# Altium project IRIS-FE-01-B.PrjPCB
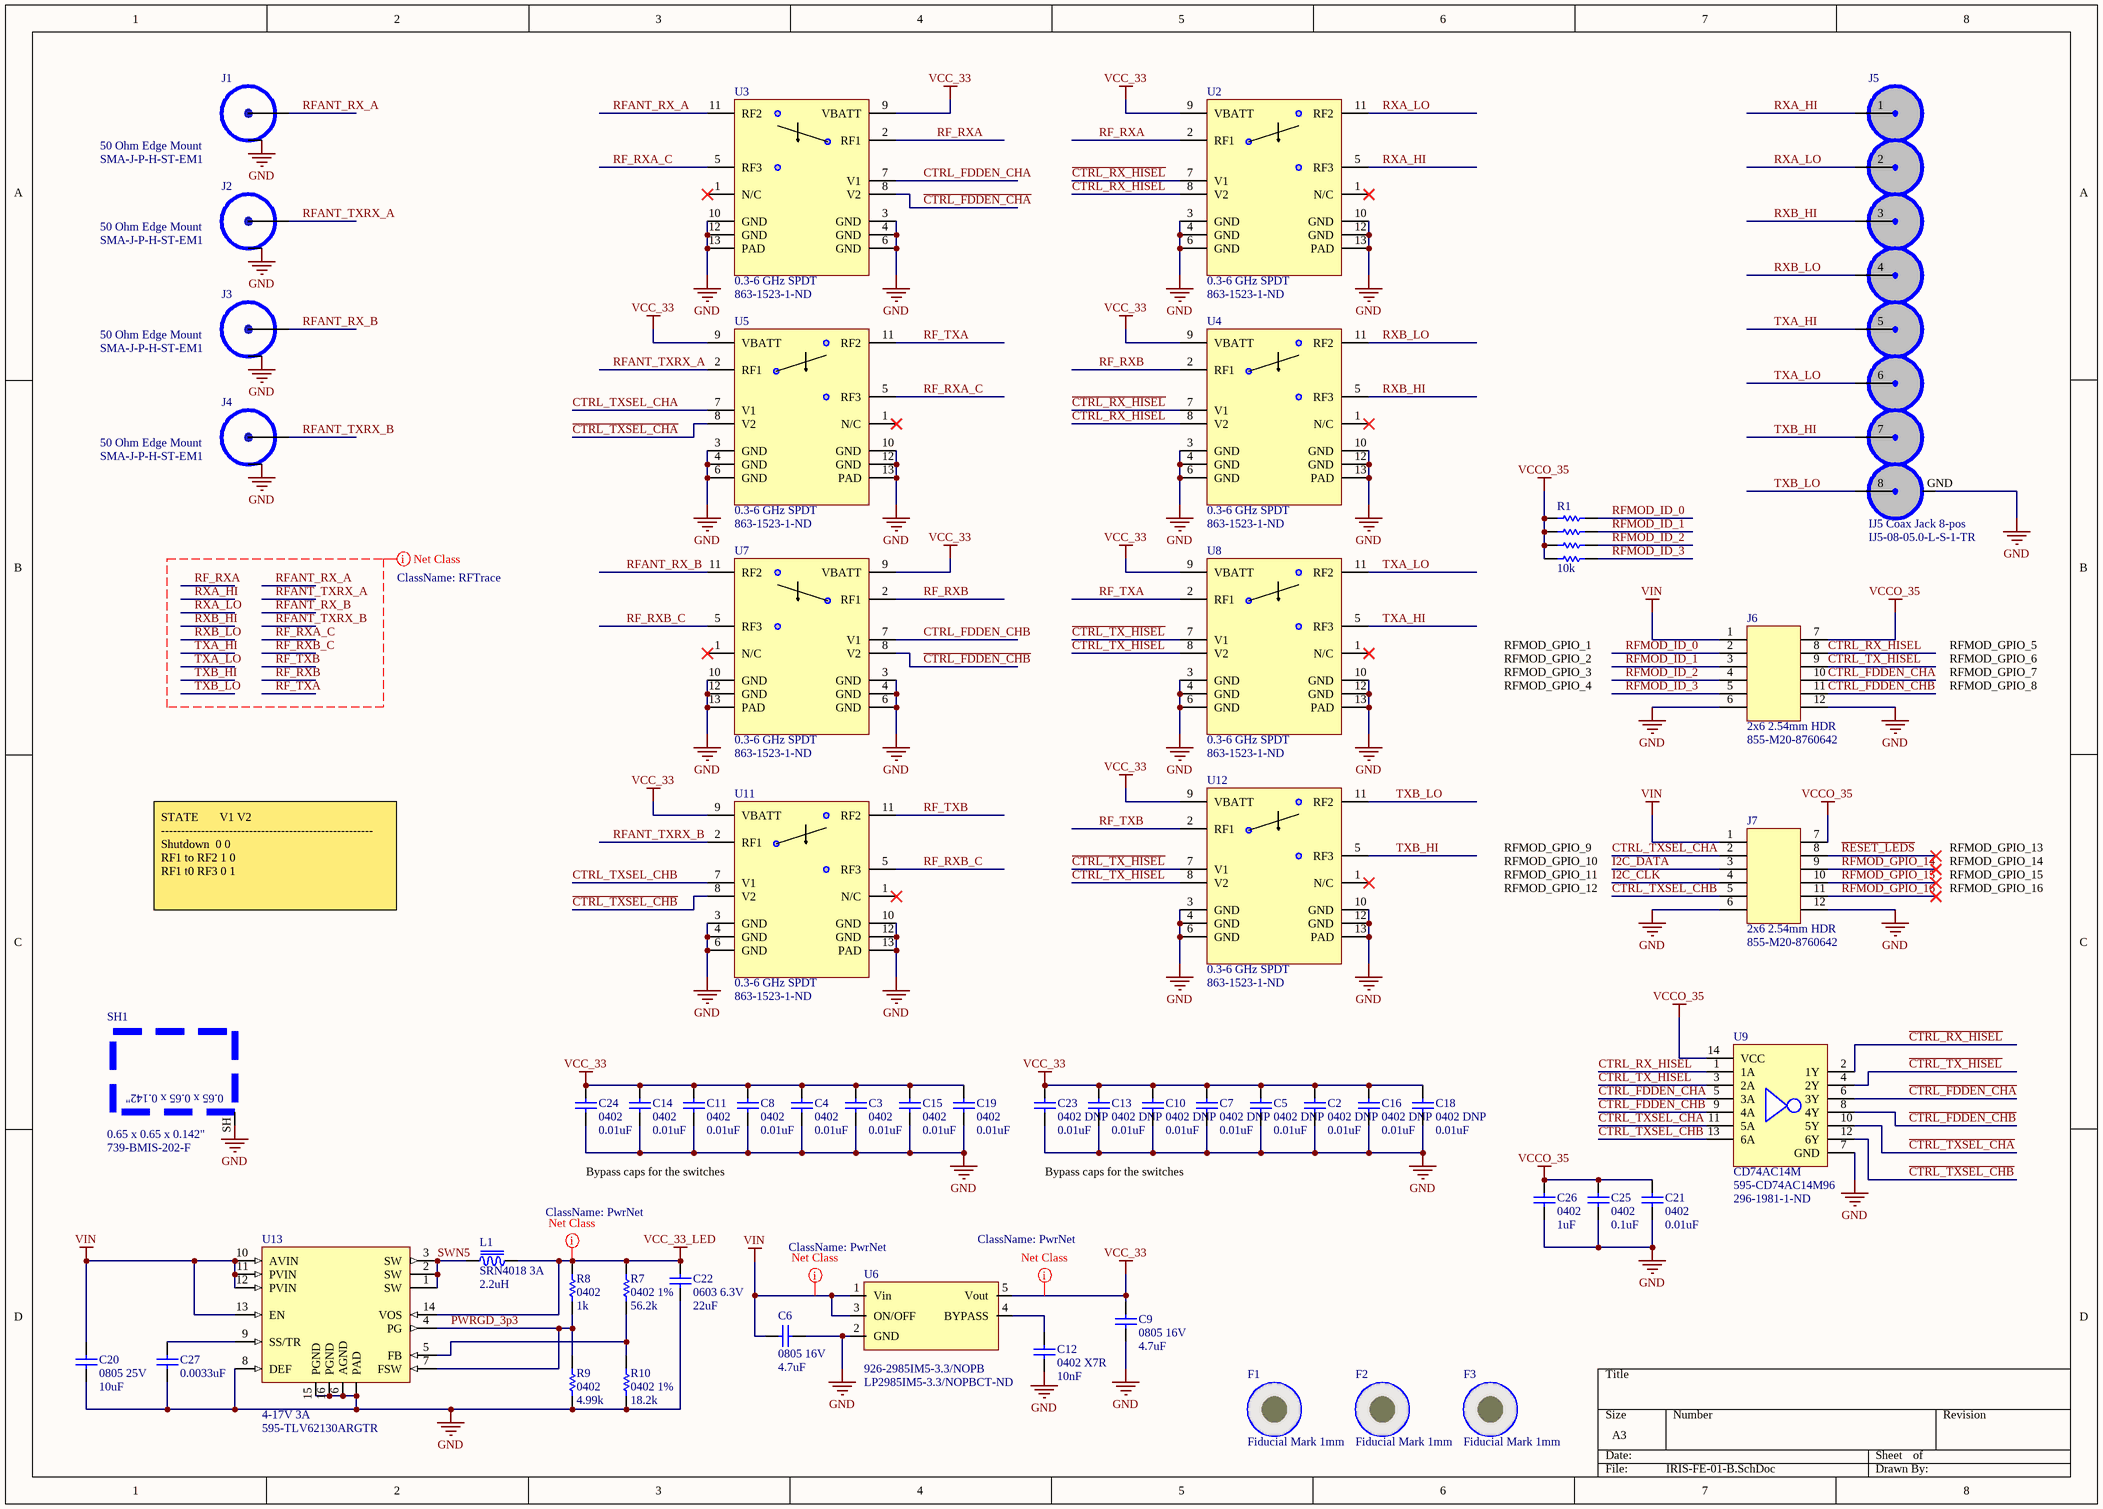
[diagram p0: IRIS-FE-01-B.SchDoc]
2 sheets, 79 parts. Net scope: global (net labels, ports and power ports of the same name join across sheets).
Board file: IRIS-FE-01-B.PcbDoc
Sheets:
  IRIS-FE-01-B.SchDoc
  IRIS-FE-01-B-LEDs.SchDoc

## Sheet IRIS-FE-01-B.SchDoc
size A3

### Parts
C2  0402 DNP  value 0.01uF  [0402_SMT_CAP]
C3  0402  value 0.01uF  [0402_SMT_CAP]
C4  0402  value 0.01uF  [0402_SMT_CAP]
C5  0402 DNP  value 0.01uF  [0402_SMT_CAP]
C6  0805 16V  value 4.7uF  [0805_SMT_CAP]
C7  0402 DNP  value 0.01uF  [0402_SMT_CAP]
C8  0402  value 0.01uF  [0402_SMT_CAP]
C9  0805 16V  value 4.7uF  [0805_SMT_CAP]
C10  0402 DNP  value 0.01uF  [0402_SMT_CAP]
C11  0402  value 0.01uF  [0402_SMT_CAP]
C12  0402 X7R  value 10nF  [0402_SMT_CAP]
C13  0402 DNP  value 0.01uF  [0402_SMT_CAP]
C14  0402  value 0.01uF  [0402_SMT_CAP]
C15  0402  value 0.01uF  [0402_SMT_CAP]
C16  0402 DNP  value 0.01uF  [0402_SMT_CAP]
C18  0402 DNP  value 0.01uF  [0402_SMT_CAP]
C19  0402  value 0.01uF  [0402_SMT_CAP]
C20  0805 25V  value 10uF  [0805_SMT_CAP]
C21  0402  value 0.01uF  [0402_SMT_CAP]
C22  0603 6.3V  value 22uF  [0603_SMT_CAP]
C23  0402 DNP  value 0.01uF  [0402_SMT_CAP]
C24  0402  value 0.01uF  [0402_SMT_CAP]
C25  0402  value 0.1uF  [0402_SMT_CAP]
C26  0402  value 1uF  [0402_SMT_CAP]
C27  value 0.0033uF  [0402_SMT_CAP]  (hidden comment: 0402)
F1  Fiducial Mark 1mm  [1mm_FIDUCIAL]
F2  Fiducial Mark 1mm  [1mm_FIDUCIAL]
F3  Fiducial Mark 1mm  [1mm_FIDUCIAL]
J1  50 Ohm Edge Mount  Manufacturer Part Number 1: SMA-J-P-H-ST-EM1  [SMA-J-P-X-ST-EM1]
J2  50 Ohm Edge Mount  Manufacturer Part Number 1: SMA-J-P-H-ST-EM1  [SMA-J-P-X-ST-EM1]
J3  50 Ohm Edge Mount  Manufacturer Part Number 1: SMA-J-P-H-ST-EM1  [SMA-J-P-X-ST-EM1]
J4  50 Ohm Edge Mount  Manufacturer Part Number 1: SMA-J-P-H-ST-EM1  [SMA-J-P-X-ST-EM1]
J5  IJ5 Coax Jack 8-pos  [IJ5-08-05.0-L-S-1-TR]
J6  2x6 2.54mm HDR  Supplier Part Number 1: 855-M20-8760642  [M20-876-350012]
J7  2x6 2.54mm HDR  Supplier Part Number 1: 855-M20-8760642  [M20-876-350012]
L1  SRN4018 3A  value 2.2uH  [srn4018]
R1  value 10k  [EXB28V]  (hidden comment: 0402 Array)
R7  0402 1%  value 56.2k  [0402_SMT_RES]
R8  0402  value 1k  [0402_SMT_RES]
R9  0402  value 4.99k  [0402_SMT_RES]
R10  0402 1%  value 18.2k  [0402_SMT_RES]
SH1  0.65 x 0.65 x 0.142"  Supplier Part Number 1: 739-BMIS-202-F  [BMIS-202]
U2  0.3-6 GHz SPDT  Supplier Part Number 1: 863-1523-1-ND  [SKY13374-397LF-QFN12]
U3  0.3-6 GHz SPDT  Supplier Part Number 1: 863-1523-1-ND  [SKY13374-397LF-QFN12]
U4  0.3-6 GHz SPDT  Supplier Part Number 1: 863-1523-1-ND  [SKY13374-397LF-QFN12]
U5  0.3-6 GHz SPDT  Supplier Part Number 1: 863-1523-1-ND  [SKY13374-397LF-QFN12]
U6  Supplier Part Number 1: 926-2985IM5-3.3/NOPB  Supplier Part Number 2: LP2985IM5-3.3/NOPBCT-ND  [DBV_SOT-23-5]  (hidden comment: LP2985IM5-3.3)
U7  0.3-6 GHz SPDT  Supplier Part Number 1: 863-1523-1-ND  [SKY13374-397LF-QFN12]
U8  0.3-6 GHz SPDT  Supplier Part Number 1: 863-1523-1-ND  [SKY13374-397LF-QFN12]
U9  CD74AC14M  Supplier Part Number 1: 595-CD74AC14M96  Supplier Part Number 2: 296-1981-1-ND  [TI-SOIC127P600X175-14N]
U11  0.3-6 GHz SPDT  Supplier Part Number 1: 863-1523-1-ND  [SKY13374-397LF-QFN12]
U12  0.3-6 GHz SPDT  Supplier Part Number 1: 863-1523-1-ND  [SKY13374-397LF-QFN12]
U13  4-17V 3A  Supplier Part Number 1: 595-TLV62130ARGTR  [S-PVQFN-N16]

### Nets
GND: C2.2 C3.2 C4.2 C5.2 C6.2 C7.2 C8.2 C9.2 C10.2 C11.2 C12.1 C13.2 C14.2 C15.2 C16.2 C18.2 C19.2 C20.1 C21.2 C22.2 C23.2 C24.2 C25.1 C26.2 C27.1 J1.2(GND) J2.2(GND) J3.2(GND) J4.2(GND) J5.GND J6.6 J6.12 J7.6 J7.12 R9.1 R10.1 SH1.SH U2.3(GND) U2.4(GND) U2.6(GND) U2.10(GND) U2.12(GND) U2.13(PAD) U3.3(GND) U3.4(GND) U3.6(GND) U3.10(GND) U3.12(GND) U3.13(PAD) U4.3(GND) U4.4(GND) U4.6(GND) U4.10(GND) U4.12(GND) U4.13(PAD) U5.3(GND) U5.4(GND) U5.6(GND) U5.10(GND) U5.12(GND) U5.13(PAD) U6.2(GND) U7.3(GND) U7.4(GND) U7.6(GND) U7.10(GND) U7.12(GND) U7.13(PAD) U8.3(GND) U8.4(GND) U8.6(GND) U8.10(GND) U8.12(GND) U8.13(PAD) U9.7(GND) U11.3(GND) U11.4(GND) U11.6(GND) U11.10(GND) U11.12(GND) U11.13(PAD) U12.3(GND) U12.4(GND) U12.6(GND) U12.10(GND) U12.12(GND) U12.13(PAD) U13.6(AGND) U13.8(DEF) U13.15(PGND) U13.16(PGND) U13.17(PAD)
VCC_33: C2.1 C3.1 C4.1 C5.1 C7.1 C8.1 C9.1 C10.1 C11.1 C13.1 C14.1 C15.1 C16.1 C18.1 C19.1 C23.1 C24.1 U2.9(VBATT) U3.9(VBATT) U4.9(VBATT) U5.9(VBATT) U6.5(Vout) U7.9(VBATT) U8.9(VBATT) U11.9(VBATT) U12.9(VBATT)
VCC_33_LED: C22.1 L1.2 R7.2 R8.2 U13.14(VOS)
VCCO_35: C21.1 C25.2 C26.1 J6.7 J7.7 R1.1 R1.2 R1.3 R1.4 U9.14(VCC)
VIN: C6.1 C20.2 J6.1 J7.1 U6.1(Vin) U6.3(ON/OFF) U13.10(AVIN) U13.11(PVIN) U13.12(PVIN) U13.13(EN)
~{CTRL_FDDEN_CHA}: U3.8(V2) U9.6(3Y)
~{CTRL_FDDEN_CHB}: U7.8(V2) U9.8(4Y)
~{CTRL_RX_HISEL}: U2.7(V1) U4.7(V1) U9.2(1Y)
~{CTRL_TX_HISEL}: U8.7(V1) U9.4(2Y) U12.7(V1)
~{CTRL_TXSEL_CHA}: U5.8(V2) U9.10(5Y)
~{CTRL_TXSEL_CHB}: U9.12(6Y) U11.8(V2)
~{RESET_LEDS}: J7.8
CTRL_FDDEN_CHA: J6.10 U3.7(V1) U9.5(3A)
CTRL_FDDEN_CHB: J6.11 U7.7(V1) U9.9(4A)
CTRL_RX_HISEL: J6.8 U2.8(V2) U4.8(V2) U9.1(1A)
CTRL_TX_HISEL: J6.9 U8.8(V2) U9.3(2A) U12.8(V2)
CTRL_TXSEL_CHA: J7.2 U5.7(V1) U9.11(5A)
CTRL_TXSEL_CHB: J7.5 U9.13(6A) U11.7(V1)
I2C_CLK: J7.4
I2C_DATA: J7.3
PWRGD_3p3: R8.1 R9.2 U13.4(PG) U13.7(FSW)
RF_RXA: U2.2(RF1) U3.2(RF1)
RF_RXA_C: U3.5(RF3) U5.5(RF3)
RF_RXB: U4.2(RF1) U7.2(RF1)
RF_RXB_C: U7.5(RF3) U11.5(RF3)
RF_TXA: U5.11(RF2) U8.2(RF1)
RF_TXB: U11.11(RF2) U12.2(RF1)
RFANT_RX_A: J1.1(SIG) U3.11(RF2)
RFANT_RX_B: J3.1(SIG) U7.11(RF2)
RFANT_TXRX_A: J2.1(SIG) U5.2(RF1)
RFANT_TXRX_B: J4.1(SIG) U11.2(RF1)
RFMOD_GPIO_14: J7.9
RFMOD_GPIO_15: J7.10
RFMOD_GPIO_16: J7.11
RFMOD_ID_0: J6.2 R1.8
RFMOD_ID_1: J6.3 R1.7
RFMOD_ID_2: J6.4 R1.6
RFMOD_ID_3: J6.5 R1.5
RXA_HI: J5.1 U2.5(RF3)
RXA_LO: J5.2 U2.11(RF2)
RXB_HI: J5.3 U4.5(RF3)
RXB_LO: J5.4 U4.11(RF2)
SWN5: L1.1 U13.1(SW) U13.2(SW) U13.3(SW)
TXA_HI: J5.5 U8.5(RF3)
TXA_LO: J5.6 U8.11(RF2)
TXB_HI: J5.7 U12.5(RF3)
TXB_LO: J5.8 U12.11(RF2)
NetC12_2: C12.2 U6.4(BYPASS)
NetC27_2: C27.2 U13.9(SS/TR)
NetR7_1: R7.1 R10.2 U13.5(FB)

Not connected (* = marked no-connect by the designer): U2 1(N/C)*; U3 1(N/C)*; U4 1(N/C)*; U5 1(N/C)*; U7 1(N/C)*; U8 1(N/C)*; U11 1(N/C)*; U12 1(N/C)*

### Layout directives
net class PwrNet: VCC_33, VCC_33_LED, VIN
net class RFTrace: RF_RXA, RF_RXA_C, RF_RXB, RF_RXB_C, RF_TXA, RF_TXB, RFANT_RX_A, RFANT_RX_B, RFANT_TXRX_A, RFANT_TXRX_B, RXA_HI, RXA_LO, RXB_HI, RXB_LO, TXA_HI, TXA_LO, TXB_HI, TXB_LO

### Notes on the sheet
- RFMOD_GPIO_1
- RFMOD_GPIO_5
- RFMOD_GPIO_2
- RFMOD_GPIO_3
- RFMOD_GPIO_4
- RFMOD_GPIO_6
- RFMOD_GPIO_7
- RFMOD_GPIO_8
- RFMOD_GPIO_9
- RFMOD_GPIO_13
- STATE     		V1	V2
  -----------------------------------------------------
  Shutdown		0	0
  RF1 to RF2	1	0
  RF1 t0 RF3	0	1
- RFMOD_GPIO_10
- RFMOD_GPIO_11
- RFMOD_GPIO_12
- RFMOD_GPIO_14
- RFMOD_GPIO_15
- RFMOD_GPIO_16
- Bypass caps for the switches

### Library data of the parts
C2-C5 C7 C8 C10 C11 C13-C16 C18 C19 C21 C23-C27 = Cap_0402: 0402 SMT Capacitor; Supplier 1: Mouser
  C2-C5 C7 C8 C10 C11 C13-C16 C18 C19 C21 C23 C24: Supplier Part Number 1: 81-GRM155R71H103KA8D
  C25: Supplier Part Number 1: 81-GRM155R71C104JA8D
  C26: Supplier Part Number 1: 81-GRM155R61E105KA2D
  C27: Supplier Part Number 1: 81-GRM155R71H332KA1J
C6 C9 C20 = Cap_0805: 0805 SMT Capacitor; Supplier 1: Mouser
  C6 C9: Supplier Part Number 1: 81-GRJ21BR71C475KE1L
  C20: Supplier Part Number 1: 81-GRM219R61E106KA2D
C12 = Cap Semi: Capacitor (Semiconductor SIM Model); Published: 8-Jun-2000; LatestRevisionDate: 29-May-2009; LatestRevisionNote: IPC-7351 Footprint Added.; PackageReference: C1206; Publisher: Altium Limited; PackageDescription: Chip Capacitor; Supplier 1: Mouser; Supplier Part Number 1: 81-GCM155R71H103KA5D
C22 = Cap_0603: 0603 SMT Capacitor; Supplier 1: Mouser; Supplier Part Number 1: 81-GRM188R60J226ME0D
F1-F3 = Fiducial-1mm
J1-J4 = SMA-J-P-X-ST-EM1: Samtec SMA Edge Mount 50 Ohm; Manufacturer 1: Samtec; Supplier 1: Samtec; Supplier Part Number 1: SMA-J-P-H-ST-EM1
J5 = IJ5-08-05.0-X-S-1_1: Samtec 50 Ohm High Isolation RF Jack, 4-pos; Manufacturer 1: Samtec; Manufacturer Part Number 1: IJ5-08-05.0-L-S-1-TR; Supplier 1: Samtec; Supplier Part Number 1: IJ5-08-05.0-L-S-1-TR
J6 J7 = M20-8760642: Harwin 2.54mm Thru Straight Recepticle; Supplier 1: Mouser
L1 = SRN4018: SRN4018 Semi-Shielded SMT Power Inductor; Supplier 1: Mouser; Supplier Part Number 1: 652-SRN4018-2R2M
R1 = Res_0402_4xArray: 0402 SMT Resistor Array; Supplier 1: Mouser; Supplier Part Number 1: 667-EXB-28V103JX; Supplier 2: Digi-Key; Supplier Part Number 2: Y7103CT-ND
R7-R10 = Res_0402: 0402 SMT Resistor; Supplier 1: Mouser
  R7: Supplier Part Number 1: 667-ERJ-2RKF5622X
  R8: Supplier Part Number 1: 667-ERJ-2RKF1001X
  R9: Supplier Part Number 1: 667-ERJ-2RKF4991X
  R10: Supplier Part Number 1: 667-ERJ-2RKF1822X
SH1 = BMI-S-202-F: EMI Shield 0.65 x 0.65 x 0.142" LairdTech 2-pc; Supplier 1: Mouser
U2-U5 U7 U8 U11 U12 = SKY13374-397LF: 300 kHz to 6.0 GHz SPDT Switch 2x2mm QFN; Supplier 1: Digi-Key
U6 = LP2985IM5-3.3: TO LDO 3.3V 150mA Regulator w/ ON/OFF; Supplier 1: Mouser; Supplier 2: Digi-Key
U9 = CD74AC14M: TI Hex Inverter in SOIC; Supplier 1: Mouser; Supplier 2: Digi-Key
U13 = TLV62130: 4-17V 3A Step-Down Voltage Converter; Supplier 1: Mouser

## Sheet IRIS-FE-01-B-LEDs.SchDoc
size A
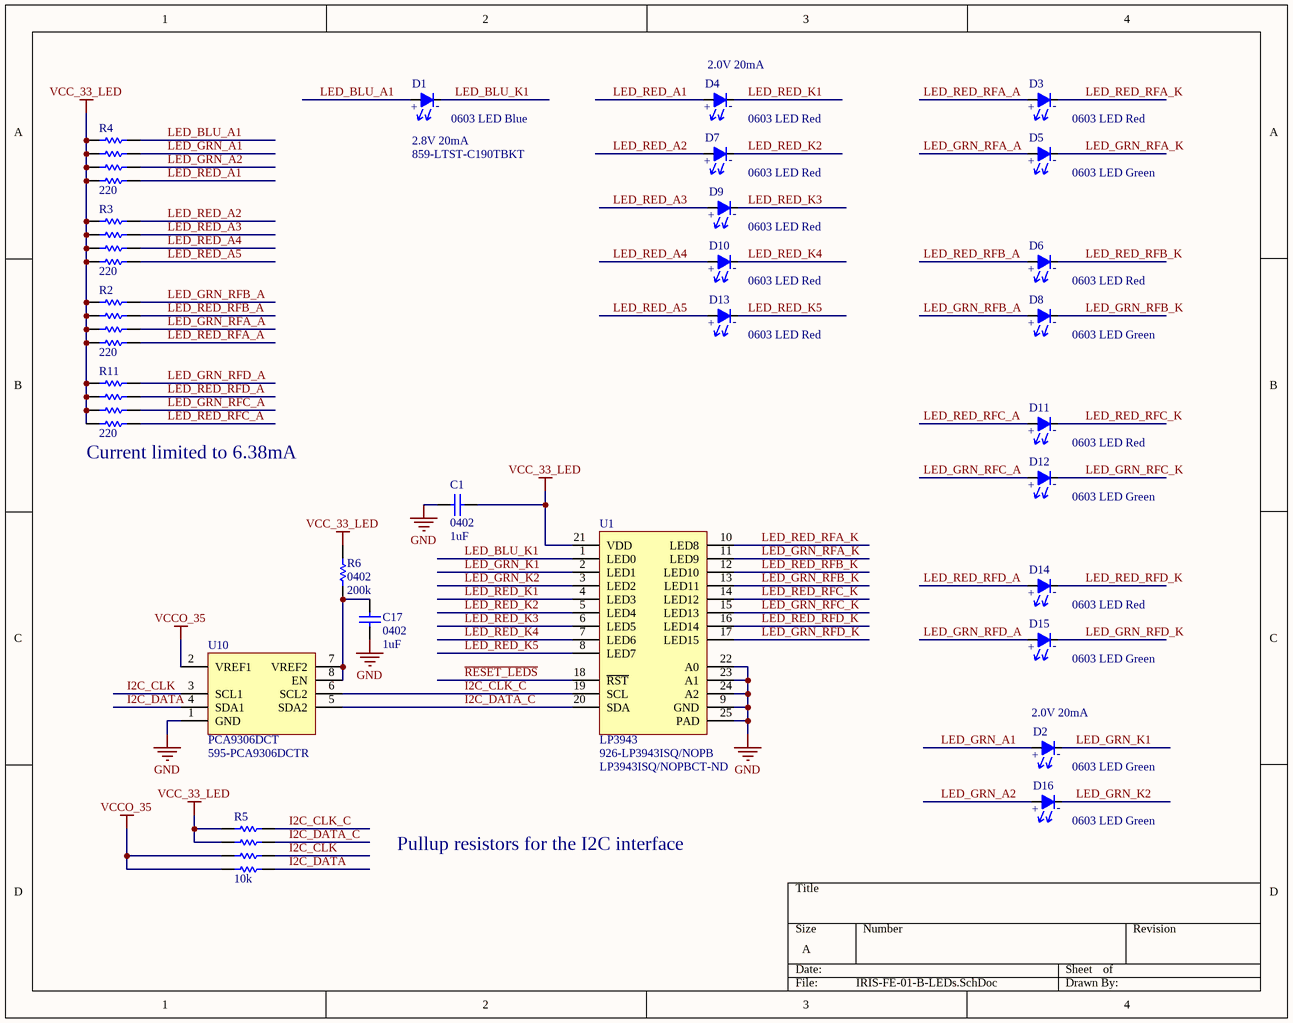
[diagram p1: IRIS-FE-01-B-LEDs.SchDoc]

### Parts
C1  0402  value 1uF  [0402_SMT_CAP]
C17  0402  value 1uF  [0402_SMT_CAP]
D1  0603 LED Blue  value 2.8V 20mA  Supplier Part Number 1: 859-LTST-C190TBKT  [0603_SMT_LED_Blue]
D2  0603 LED Green  value 2.0V 20mA  [0603_SMT_LED_Green]
D3  0603 LED Red  [0603_SMT_LED_Red]
D4  0603 LED Red  value 2.0V 20mA  [0603_SMT_LED_Red]
D5  0603 LED Green  [0603_SMT_LED_Green]
D6  0603 LED Red  [0603_SMT_LED_Red]
D7  0603 LED Red  [0603_SMT_LED_Red]
D8  0603 LED Green  [0603_SMT_LED_Green]
D9  0603 LED Red  [0603_SMT_LED_Red]
D10  0603 LED Red  [0603_SMT_LED_Red]
D11  0603 LED Red  [0603_SMT_LED_Red]
D12  0603 LED Green  [0603_SMT_LED_Green]
D13  0603 LED Red  [0603_SMT_LED_Red]
D14  0603 LED Red  [0603_SMT_LED_Red]
D15  0603 LED Green  [0603_SMT_LED_Green]
D16  0603 LED Green  [0603_SMT_LED_Green]
R2  value 220  [EXB28V]  (hidden comment: 0402 Array)
R3  value 220  [EXB28V]  (hidden comment: 0402 Array)
R4  value 220  [EXB28V]  (hidden comment: 0402 Array)
R5  value 10k  [EXB28V]  (hidden comment: 0402 Array)
R6  0402  value 200k  [0402_SMT_RES]
R11  value 220  [EXB28V]  (hidden comment: 0402 Array)
U1  LP3943  Supplier Part Number 1: 926-LP3943ISQ/NOPB  Supplier Part Number 2: LP3943ISQ/NOPBCT-ND  [TI-QFN127P600-8N]
U10  PCA9306DCT  Supplier Part Number 1: 595-PCA9306DCTR  [TI-SOP127P600-8N]

### Nets
GND: C1.2 C17.1 U1.9(GND) U1.22(A0) U1.23(A1) U1.24(A2) U1.25(PAD) U10.1(GND)
VCC_33_LED: C1.1 R2.1 R2.2 R2.3 R2.4 R3.1 R3.2 R3.3 R3.4 R4.1 R4.2 R4.3 R4.4 R5.5 R5.6 R6.2 R11.1 R11.2 R11.3 R11.4 U1.21(VDD)
VCCO_35: R5.7 R5.8 U10.2(VREF1)
~{RESET_LEDS}: U1.18(~{RST})
I2C_CLK: R5.2 U10.3(SCL1)
I2C_CLK_C: R5.4 U1.19(SCL) U10.6(SCL2)
I2C_DATA: R5.1 U10.4(SDA1)
I2C_DATA_C: R5.3 U1.20(SDA) U10.5(SDA2)
LED_BLU_A1: D1.1(P) R4.8
LED_BLU_K1: D1.2(N) U1.1(LED0)
LED_GRN_A1: D2.1(P) R4.7
LED_GRN_A2: D16.1(P) R4.6
LED_GRN_K1: D2.2(N) U1.2(LED1)
LED_GRN_K2: D16.2(N) U1.3(LED2)
LED_GRN_RFA_A: D5.1(P) R2.6
LED_GRN_RFA_K: D5.2(N) U1.11(LED9)
LED_GRN_RFB_A: D8.1(P) R2.8
LED_GRN_RFB_K: D8.2(N) U1.13(LED11)
LED_GRN_RFC_A: D12.1(P) R11.6
LED_GRN_RFC_K: D12.2(N) U1.15(LED13)
LED_GRN_RFD_A: D15.1(P) R11.8
LED_GRN_RFD_K: D15.2(N) U1.17(LED15)
LED_RED_A1: D4.1(P) R4.5
LED_RED_A2: D7.1(P) R3.8
LED_RED_A3: D9.1(P) R3.7
LED_RED_A4: D10.1(P) R3.6
LED_RED_A5: D13.1(P) R3.5
LED_RED_K1: D4.2(N) U1.4(LED3)
LED_RED_K2: D7.2(N) U1.5(LED4)
LED_RED_K3: D9.2(N) U1.6(LED5)
LED_RED_K4: D10.2(N) U1.7(LED6)
LED_RED_K5: D13.2(N) U1.8(LED7)
LED_RED_RFA_A: D3.1(P) R2.5
LED_RED_RFA_K: D3.2(N) U1.10(LED8)
LED_RED_RFB_A: D6.1(P) R2.7
LED_RED_RFB_K: D6.2(N) U1.12(LED10)
LED_RED_RFC_A: D11.1(P) R11.5
LED_RED_RFC_K: D11.2(N) U1.14(LED12)
LED_RED_RFD_A: D14.1(P) R11.7
LED_RED_RFD_K: D14.2(N) U1.16(LED14)
NetC17_2: C17.2 R6.1 U10.7(VREF2) U10.8(EN)

### Notes on the sheet
- (near R11) Current limited to 6.38mA
- Pullup resistors for the I2C interface
- (in symbol LED_0603_BLUE) +; -
- (in symbol LED_0603_GREEN) +; -
- (in symbol LED_0603_RED) +; -

### Library data of the parts
C1 C17 = Cap_0402: 0402 SMT Capacitor; Supplier 1: Mouser; Supplier Part Number 1: 81-GRM155R61E105KA2D
D1 = LED_0603_BLUE: 0603 LED with Polar Markings; Supplier 1: Mouser
D2 = LED_0603_GREEN: 0603 LED with Polar Markings; Supplier 1: Mouser; Supplier Part Number 1: 859-LTST-C191KGKT
D3 D6 D7 D9-D11 D13 D14 = LED_0603_RED: 0603 LED with Polar Markings; Value: 2.0V 20mA; Supplier 1: Mouser; Supplier Part Number 1: 859-LTST-C191KRKT
D4 = LED_0603_RED: 0603 LED with Polar Markings; Supplier 1: Mouser; Supplier Part Number 1: 859-LTST-C191KRKT
D5 D8 D12 D15 D16 = LED_0603_GREEN: 0603 LED with Polar Markings; Value: 2.0V 20mA; Supplier 1: Mouser; Supplier Part Number 1: 859-LTST-C191KGKT
R2-R5 R11 = Res_0402_4xArray: 0402 SMT Resistor Array; Supplier 1: Mouser
  R2-R4 R11: Supplier Part Number 1: 667-EXB-28V221JX
  R5: Supplier Part Number 1: 667-EXB-28V103JX; Supplier 2: Digi-Key; Supplier Part Number 2: Y7103CT-ND
R6 = Res_0402: 0402 SMT Resistor; Supplier 1: Mouser; Supplier Part Number 1: 667-ERJ-2RKF2003X
U1 = LP3943: TI 16-LED Fun Light Driver with I2C; Supplier 1: Mouser; Supplier 2: Digi-Key
U10 = PCA9306DCT: TI I2C Bidirectional Voltage Translator; Supplier 1: Mouser

## Nets that join several sheets
GND: IRIS-FE-01-B (92 pins), IRIS-FE-01-B-LEDs (8 pins)
VCC_33_LED: IRIS-FE-01-B (5 pins), IRIS-FE-01-B-LEDs (21 pins)
VCCO_35: IRIS-FE-01-B (10 pins), IRIS-FE-01-B-LEDs (R5.7 R5.8 U10.2)
~{RESET_LEDS}: IRIS-FE-01-B (J7.8), IRIS-FE-01-B-LEDs (U1.18)
I2C_CLK: IRIS-FE-01-B (J7.4), IRIS-FE-01-B-LEDs (R5.2 U10.3)
I2C_DATA: IRIS-FE-01-B (J7.3), IRIS-FE-01-B-LEDs (R5.1 U10.4)

## Assembly variants
Normal: not fitted C2 C5 C7 C10 C13 C16 C18 C23